# Altium project PCB_Braco_Robotico.PrjPcb
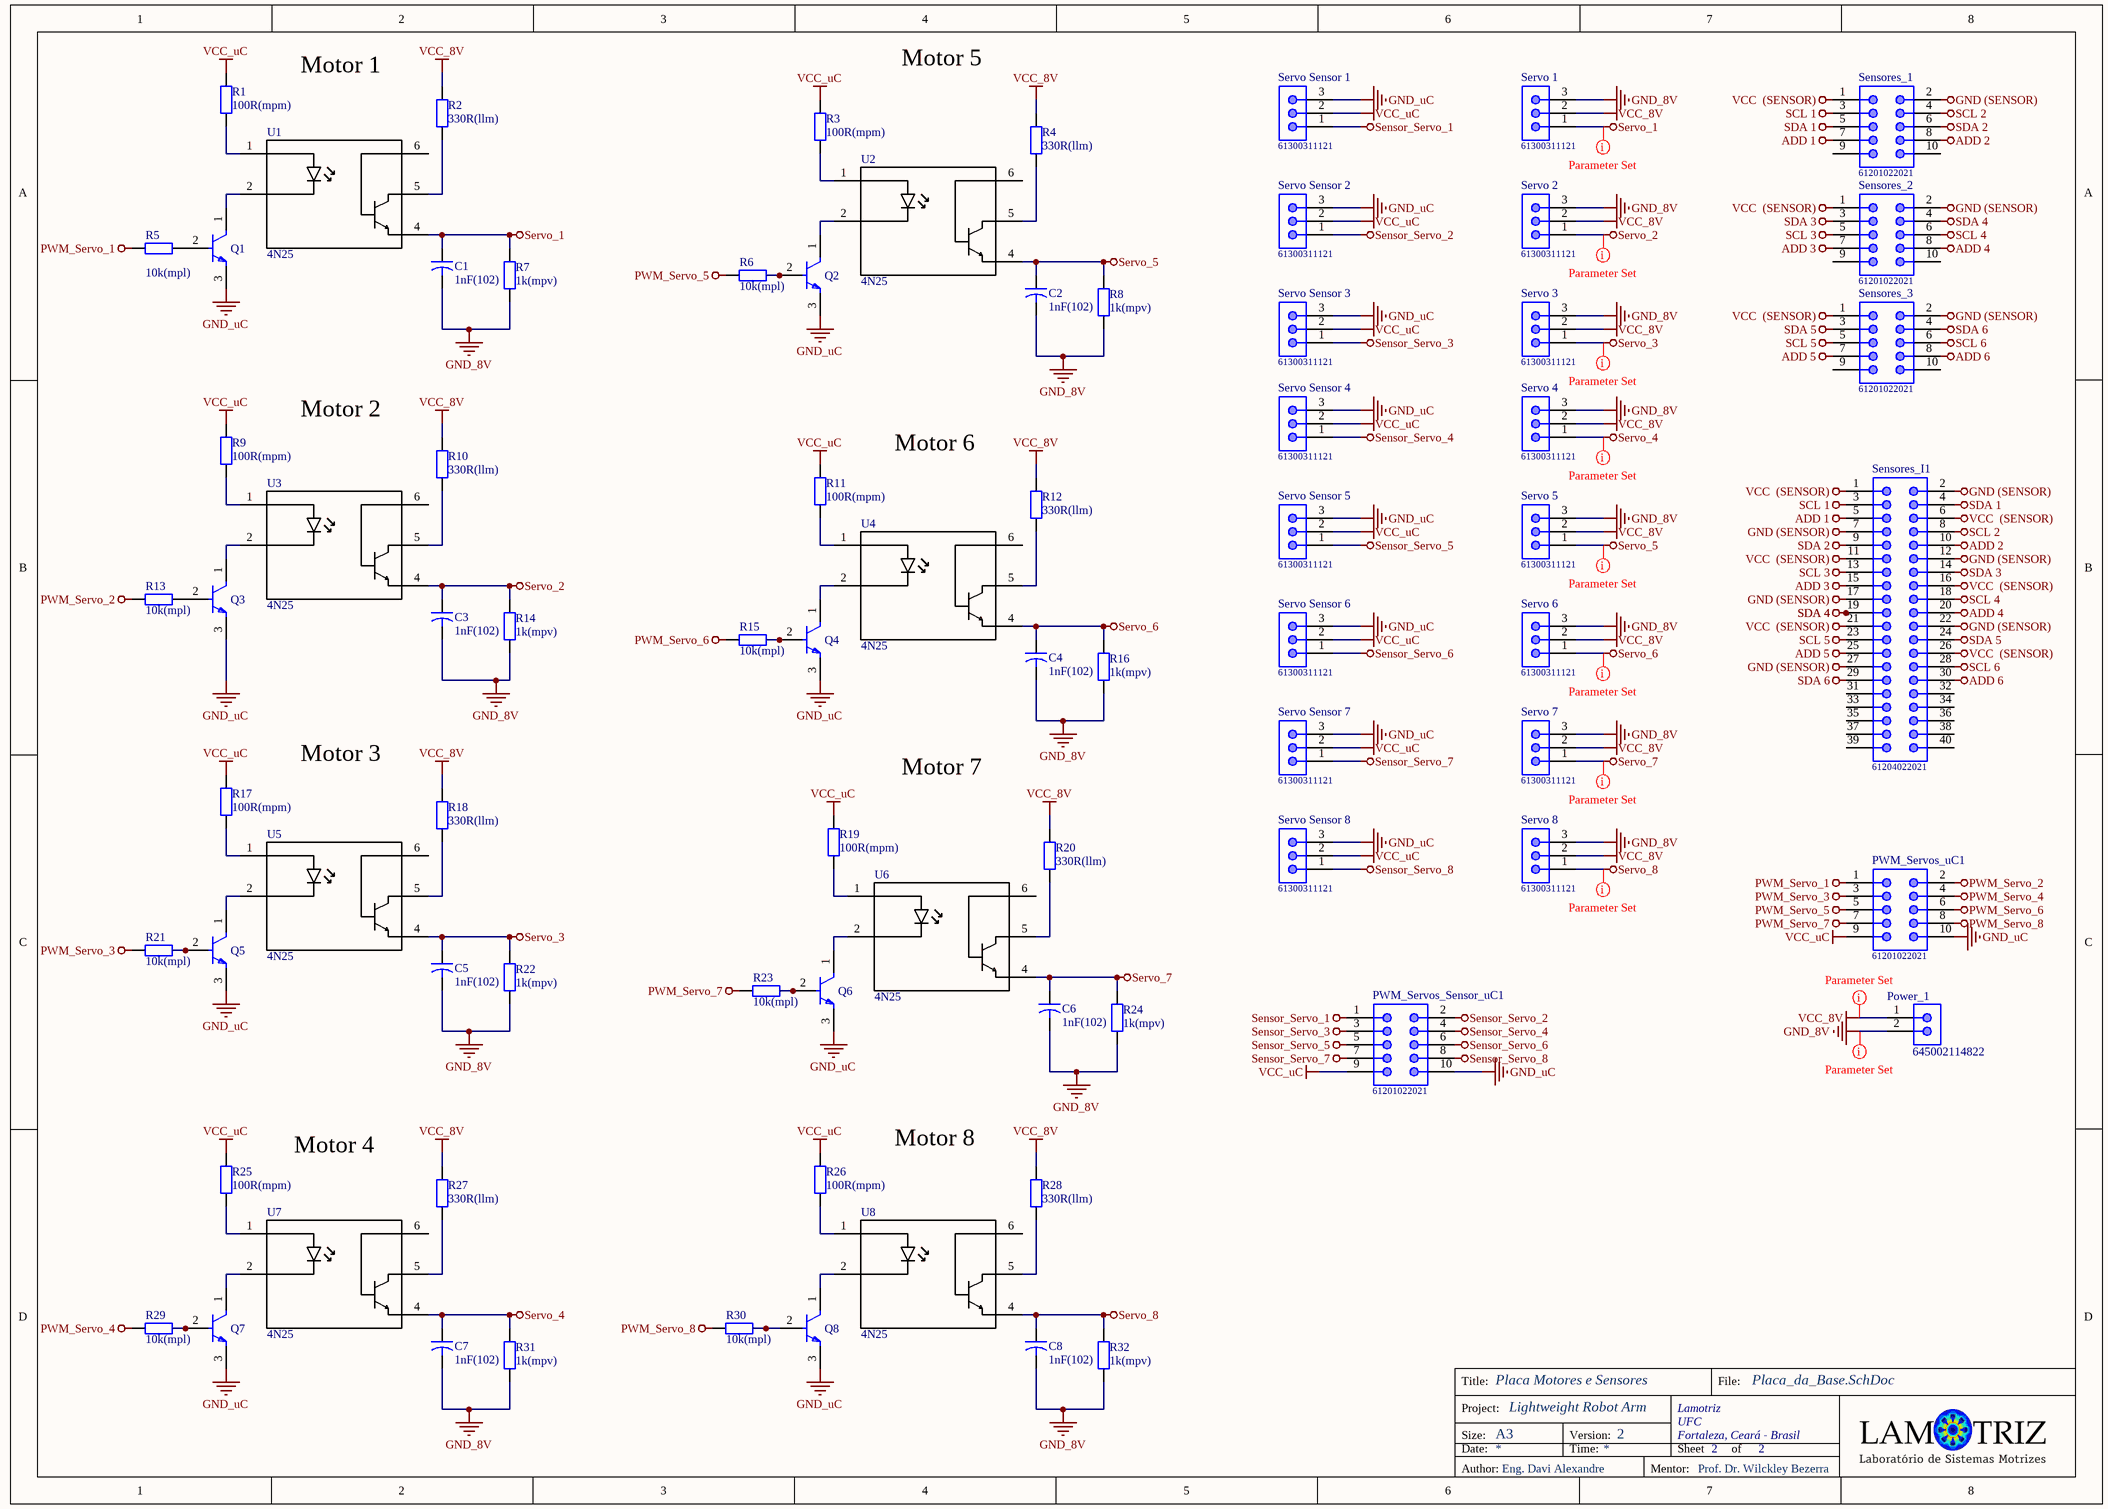
[diagram p0: Placa_da_Base.SchDoc]
PojectName: Lightweight Robot Arm
2 sheets, 85 parts. Net scope: global (net labels, ports and power ports of the same name join across sheets).
Board files: view_PCB_5_Braco_so_motores.PcbDoc, view_PCB_4_Sensores.PcbDoc, view_PCB_3_uC.PcbDoc, PCB_5_Braco_so_motores.PcbDoc, PCB_4_Sensores.PcbDoc, PCB_3_uC.PcbDoc
Sheets:
  Placa_da_Base.SchDoc
  Placa_do_uControlador.SchDoc

## Sheet Placa_da_Base.SchDoc: Placa Motores e Sensores
size A3; Author: Eng. Davi Alexandre; CompanyName: Lamotriz; Organization: UFC; Address1: Fortaleza, Ceará - Brasil; Revision: Prof. Dr. Wilckley Bezerra; SheetNumber: 2; SheetTotal: 2; Machine: Lightweight Robot Arm; VersionProject: 2

### Parts
C1  1nF(102)  [CAPR5-4X5]
C2  1nF(102)  [CAPR5-4X5]
C3  1nF(102)  [CAPR5-4X5]
C4  1nF(102)  [CAPR5-4X5]
C5  1nF(102)  [CAPR5-4X5]
C6  1nF(102)  [CAPR5-4X5]
C7  1nF(102)  [CAPR5-4X5]
C8  1nF(102)  [CAPR5-4X5]
Power_1  645002114822  [645002114822]
PWM_Servos_Sensor_uC1  61201022021  [61201022021]
PWM_Servos_uC1  61201022021  [61201022021]
Q1  Trans_Fairchild_BC547_eec  [Fairchild_BC547_0]  (value not drawn)
Q2  Trans_Fairchild_BC547_eec  [Fairchild_BC547_0]  (value not drawn)
Q3  Trans_Fairchild_BC547_eec  [Fairchild_BC547_0]  (value not drawn)
Q4  Trans_Fairchild_BC547_eec  [Fairchild_BC547_0]  (value not drawn)
Q5  Trans_Fairchild_BC547_eec  [Fairchild_BC547_0]  (value not drawn)
Q6  Trans_Fairchild_BC547_eec  [Fairchild_BC547_0]  (value not drawn)
Q7  Trans_Fairchild_BC547_eec  [Fairchild_BC547_0]  (value not drawn)
Q8  Trans_Fairchild_BC547_eec  [Fairchild_BC547_0]  (value not drawn)
R1  100R(mpm)  [AXIAL-0.4]
R2  330R(llm)  [AXIAL-0.4]
R3  100R(mpm)  [AXIAL-0.4]
R4  330R(llm)  [AXIAL-0.4]
R5  10k(mpl)  [AXIAL-0.4]
R6  10k(mpl)  [AXIAL-0.4]
R7  1k(mpv)  [AXIAL-0.4]
R8  1k(mpv)  [AXIAL-0.4]
R9  100R(mpm)  [AXIAL-0.4]
R10  330R(llm)  [AXIAL-0.4]
R11  100R(mpm)  [AXIAL-0.4]
R12  330R(llm)  [AXIAL-0.4]
R13  10k(mpl)  [AXIAL-0.4]
R14  1k(mpv)  [AXIAL-0.4]
R15  10k(mpl)  [AXIAL-0.4]
R16  1k(mpv)  [AXIAL-0.4]
R17  100R(mpm)  [AXIAL-0.4]
R18  330R(llm)  [AXIAL-0.4]
R19  100R(mpm)  [AXIAL-0.4]
R20  330R(llm)  [AXIAL-0.4]
R21  10k(mpl)  [AXIAL-0.4]
R22  1k(mpv)  [AXIAL-0.4]
R23  10k(mpl)  [AXIAL-0.4]
R24  1k(mpv)  [AXIAL-0.4]
R25  100R(mpm)  [AXIAL-0.4]
R26  100R(mpm)  [AXIAL-0.4]
R27  330R(llm)  [AXIAL-0.4]
R28  330R(llm)  [AXIAL-0.4]
R29  10k(mpl)  [AXIAL-0.4]
R30  10k(mpl)  [AXIAL-0.4]
R31  1k(mpv)  [AXIAL-0.4]
R32  1k(mpv)  [AXIAL-0.4]
Sensores_1  61201022021  [61201022021]
Sensores_2  61201022021  [61201022021]
Sensores_3  61201022021  [61201022021]
Sensores_I1  61204022021  [61204022021]
Servo_1  61300311121  [61300311121]
Servo_2  61300311121  [61300311121]
Servo_3  61300311121  [61300311121]
Servo_4  61300311121  [61300311121]
Servo_5  61300311121  [61300311121]
Servo_6  61300311121  [61300311121]
Servo_7  61300311121  [61300311121]
Servo_8  61300311121  [61300311121]
Servo_Sensor_1  61300311121  [61300311121]
Servo_Sensor_2  61300311121  [61300311121]
Servo_Sensor_3  61300311121  [61300311121]
Servo_Sensor_4  61300311121  [61300311121]
Servo_Sensor_5  61300311121  [61300311121]
Servo_Sensor_6  61300311121  [61300311121]
Servo_Sensor_7  61300311121  [61300311121]
Servo_Sensor_8  61300311121  [61300311121]
U1  4N25  [*DIP762W50P254L712H400Q6N]
U2  4N25  [*DIP762W50P254L712H400Q6N]
U3  4N25  [*DIP762W50P254L712H400Q6N]
U4  4N25  [*DIP762W50P254L712H400Q6N]
U5  4N25  [*DIP762W50P254L712H400Q6N]
U6  4N25  [*DIP762W50P254L712H400Q6N]
U7  4N25  [*DIP762W50P254L712H400Q6N]
U8  4N25  [*DIP762W50P254L712H400Q6N]

### Nets
ADD 1: Sensores_1.7 Sensores_2.7 Sensores_3.7 Sensores_I1.5 Sensores_I1.15 Sensores_I1.25  [also labelled ADD 3, ADD 5]  [project net 3V3_uC]
ADD 2: PWM_Servos_Sensor_uC1.10 PWM_Servos_uC1.10 Q1.3(E) Q2.3(E) Q3.3(E) Q4.3(E) Q5.3(E) Q6.3(E) Q7.3(E) Q8.3(E) Sensores_1.8 Sensores_2.8 Sensores_3.8 Sensores_I1.10 Sensores_I1.20 Sensores_I1.30 Servo_Sensor_1.3 Servo_Sensor_2.3 Servo_Sensor_3.3 Servo_Sensor_4.3 Servo_Sensor_5.3 Servo_Sensor_6.3 Servo_Sensor_7.3 Servo_Sensor_8.3  [also labelled ADD 4, ADD 6, GND_uC]
GND (SENSOR): Sensores_1.2 Sensores_2.2 Sensores_3.2 Sensores_I1.2 Sensores_I1.7 Sensores_I1.12 Sensores_I1.17 Sensores_I1.22 Sensores_I1.27
GND_8V: C1.2 C2.2 C3.2 C4.2 C5.2 C6.2 C7.2 C8.2 Power_1.2 R7.1 R8.1 R14.1 R16.1 R22.1 R24.1 R31.1 R32.1 Servo_1.3 Servo_2.3 Servo_3.3 Servo_4.3 Servo_5.3 Servo_6.3 Servo_7.3 Servo_8.3
PWM_Servo_1: PWM_Servos_uC1.1 R5.2
PWM_Servo_2: PWM_Servos_uC1.2 R13.2
PWM_Servo_3: PWM_Servos_uC1.3 R21.2
PWM_Servo_4: PWM_Servos_uC1.4 R29.2
PWM_Servo_5: PWM_Servos_uC1.5 R6.2
PWM_Servo_6: PWM_Servos_uC1.6 R15.2
PWM_Servo_7: PWM_Servos_uC1.7 R23.2
PWM_Servo_8: PWM_Servos_uC1.8 R30.2
SCL 1: Sensores_1.3 Sensores_1.4 Sensores_I1.3 Sensores_I1.8  [also labelled SCL 2]  [project net I2C1-SCL]
SCL 3: Sensores_2.5 Sensores_2.6 Sensores_I1.13 Sensores_I1.18  [also labelled SCL 4]  [project net I2C2-SCL]
SCL 5: Sensores_3.5 Sensores_3.6 Sensores_I1.23 Sensores_I1.28  [also labelled SCL 6]  [project net I2C3-SCL]
SDA 1: Sensores_1.5 Sensores_1.6 Sensores_I1.4 Sensores_I1.9  [also labelled SDA 2]  [project net I2C1-SDA]
SDA 3: Sensores_2.3 Sensores_2.4 Sensores_I1.14 Sensores_I1.19  [also labelled SDA 4]  [project net I2C2-SDA]
SDA 5: Sensores_3.3 Sensores_3.4 Sensores_I1.24 Sensores_I1.29  [also labelled SDA 6]  [project net I2C3-SDA]
Sensor_Servo_1: PWM_Servos_Sensor_uC1.1 Servo_Sensor_1.1
Sensor_Servo_2: PWM_Servos_Sensor_uC1.2 Servo_Sensor_2.1
Sensor_Servo_3: PWM_Servos_Sensor_uC1.3 Servo_Sensor_3.1
Sensor_Servo_4: PWM_Servos_Sensor_uC1.4 Servo_Sensor_4.1
Sensor_Servo_5: PWM_Servos_Sensor_uC1.5 Servo_Sensor_5.1
Sensor_Servo_6: PWM_Servos_Sensor_uC1.6 Servo_Sensor_6.1
Sensor_Servo_7: PWM_Servos_Sensor_uC1.7 Servo_Sensor_7.1
Sensor_Servo_8: PWM_Servos_Sensor_uC1.8 Servo_Sensor_8.1
Servo_1: C1.1 R7.2 Servo_1.1 U1.4(E)
Servo_2: C3.1 R14.2 Servo_2.1 U3.4(E)
Servo_3: C5.1 R22.2 Servo_3.1 U5.4(E)
Servo_4: C7.1 R31.2 Servo_4.1 U7.4(E)
Servo_5: C2.1 R8.2 Servo_5.1 U2.4(E)
Servo_6: C4.1 R16.2 Servo_6.1 U4.4(E)
Servo_7: C6.1 R24.2 Servo_7.1 U6.4(E)
Servo_8: C8.1 R32.2 Servo_8.1 U8.4(E)
VCC  (SENSOR): Sensores_1.1 Sensores_2.1 Sensores_3.1 Sensores_I1.1 Sensores_I1.6 Sensores_I1.11 Sensores_I1.16 Sensores_I1.21 Sensores_I1.26
VCC_8V: Power_1.1 R2.2 R4.2 R10.2 R12.2 R18.2 R20.2 R27.2 R28.2 Servo_1.2 Servo_2.2 Servo_3.2 Servo_4.2 Servo_5.2 Servo_6.2 Servo_7.2 Servo_8.2
VCC_uC: PWM_Servos_Sensor_uC1.9 PWM_Servos_uC1.9 R1.2 R3.2 R9.2 R11.2 R17.2 R19.2 R25.2 R26.2 Servo_Sensor_1.2 Servo_Sensor_2.2 Servo_Sensor_3.2 Servo_Sensor_4.2 Servo_Sensor_5.2 Servo_Sensor_6.2 Servo_Sensor_7.2 Servo_Sensor_8.2
NetQ1_1: Q1.1(C) U1.2(K)
NetQ1_2: Q1.2(B) R5.1
NetQ2_1: Q2.1(C) U2.2(K)
NetQ2_2: Q2.2(B) R6.1
NetQ3_1: Q3.1(C) U3.2(K)
NetQ3_2: Q3.2(B) R13.1
NetQ4_1: Q4.1(C) U4.2(K)
NetQ4_2: Q4.2(B) R15.1
NetQ5_1: Q5.1(C) U5.2(K)
NetQ5_2: Q5.2(B) R21.1
NetQ6_1: Q6.1(C) U6.2(K)
NetQ6_2: Q6.2(B) R23.1
NetQ7_1: Q7.1(C) U7.2(K)
NetQ7_2: Q7.2(B) R29.1
NetQ8_1: Q8.1(C) U8.2(K)
NetQ8_2: Q8.2(B) R30.1
NetR1_1: R1.1 U1.1(A)
NetR2_1: R2.1 U1.5(C)
NetR3_1: R3.1 U2.1(A)
NetR4_1: R4.1 U2.5(C)
NetR9_1: R9.1 U3.1(A)
NetR10_1: R10.1 U3.5(C)
NetR11_1: R11.1 U4.1(A)
NetR12_1: R12.1 U4.5(C)
NetR17_1: R17.1 U5.1(A)
NetR18_1: R18.1 U5.5(C)
NetR19_1: R19.1 U6.1(A)
NetR20_1: R20.1 U6.5(C)
NetR25_1: R25.1 U7.1(A)
NetR26_1: R26.1 U8.1(A)
NetR27_1: R27.1 U7.5(C)
NetR28_1: R28.1 U8.5(C)

Not connected (* = marked no-connect by the designer): Sensores_1 9 10; Sensores_2 9 10; Sensores_3 9 10; Sensores_I1 31 32 33 34 35 36 37 38 39 40; U1 6(B); U2 6(B); U3 6(B); U4 6(B); U5 6(B); U6 6(B); U7 6(B); U8 6(B)

### Layout directives
rule Width Constraint [Pref Width = 60mil    Min Width = 50mil    Max Width = 60mil]: VCC_8V
rule Width Constraint [Pref Width = 50mil    Min Width = 50mil    Max Width = 50mil]: GND_8V
rule Width Constraint [Pref Width = 30mil    Min Width = 30mil    Max Width = 30mil]: Servo_1, Servo_2, Servo_3, Servo_4, Servo_5, Servo_6, Servo_7, Servo_8

### Notes on the sheet
- Motor 1
- Motor 5
- Motor 2
- Motor 6
- Motor 3
- Motor 7
- Motor 4
- Motor 8
- Title:
- File:
- Project:
- Size:
- Date:
- A3
- Version:
- Time:
- Sheet
- of
- Author:
- Mentor:

### Library data of the parts
C1-C8 = Cap2: Capacitor; Published: 23-Sep-2002; PackageReference: CAPR5-4X5; Publisher: Altium Limited; PackageDescription: Capacitor; 2 Leads
Power_1 = 645002114822: WR-WTB THT Male Vertical Locking Header, pitch 3.96mm, 2p; Pin Number: 2; Contact Resistance: 20mOhm; Rated Current: 7A; Withstanding Voltage: 1500VAC; Working Voltage: 250VAC; ComponentLink1Description: Manufacturer; ComponentLink1URL: http://www.we-online.de; ComponentLink2Description: Datasheet; ComponentLink2URL: https://www.we-online.com/catalog/datasheet/645002114822.pdf; Pitch: 3.96mm; Published Date: January 2020; Publisher: Wurth Elektronik; Mounting Technology: THT; Packaging: Bag; Operating Temperature: -40 to +105degC; Part Number: 645002114822; Gender: Male; Type: Vertical
PWM_Servos_Sensor_uC1 PWM_Servos_uC1 Sensores_1-Sensores_3 = 61201022021: Male Box Header WR-BHD with lever, THT, Vertical, pitch 2.54 mm, 10 pins; Pitch: 2.54 mm; Working Voltage: 250 VAC; Withstanding Voltage: 500 VAC; Contact Resistance: 20 mOhm; Pin Number: 10; ComponentLink1Description: Manufacturer; ComponentLink1URL: http://www.we-online.de; ComponentLink2Description: Datasheet; ComponentLink2URL: https://katalog.we-online.de/em/datasheet/6120xx22021.pdf; Part Number: 61201022021; Published Date: August 2018; Publisher: Wurth Elektronik; Operating Temperature: -40 to 125 degC; Packaging: Tray; Gender: Male; Mounting Technology: THT; Orientation: Vertical
Q1-Q8 = Trans_Fairchild_BC547_eec: TRANS NPN 45V 0.1A TO-92; Part Number: BC547; Power: 500mW; helpURL: https://upverter.com/upn/revision/b6c8bf2a31a37ee3/; ComponentLink2Description: Datasheet; Temperature: -65°C to +150°C; Package: TO-92; Supplier 2: Mouser; Supplier 1: Digi-Key; ComponentLink1URL: https://upverter.com/upn/revision/b6c8bf2a31a37ee3/; Supplier Part Number 2: 512-BC547; Supplier Part Number 1: BC547-ND; Manufacturer: Fairchild; ComponentLink1Description: Upverter; ComponentLink2URL: https://upverter.com/datasheet/00a4bcea94b7f6a06c7169869aec7b7ac700d7c3.pdf; RoHS: TRUE; Mouser Part Number: 512-BC547; Ipc Land Pattern Name: TO-92; Temperature Range High: +150°C; Digikey Description: TRANS NPN 45V 0.1A TO-92; Digikey Part Number: BC547-ND; Lead Free: yes; Temperature Range Low: -65°C
R1 R3-R32 = Res2: Resistor; Published: 8-Jun-2000; LatestRevisionDate: 17-Jul-2002; LatestRevisionNote: Re-released for DXP Platform.; PackageReference: AXIAL-0.4; Publisher: Altium Limited; PackageDescription: Axial Device, Thru-Hole; 2 Leads; 0.4 in Pin Spacing
  R1: Value: 100R(mpm)
  R5: Value: 10k(mpl)
R2 = Res2: Resistor; Value: 10K (mpl); Published: 8-Jun-2000; LatestRevisionDate: 17-Jul-2002; LatestRevisionNote: Re-released for DXP Platform.; PackageReference: AXIAL-0.4; Publisher: Altium Limited; PackageDescription: Axial Device, Thru-Hole; 2 Leads; 0.4 in Pin Spacing
Sensores_I1 = 61204022021: Male Box Header WR-BHD with lever, THT, Vertical, pitch 2.54 mm, 40 pins; Pitch: 2.54 mm; Working Voltage: 250 VAC; Withstanding Voltage: 500 VAC; Contact Resistance: 20 mOhm; Pin Number: 40; ComponentLink1Description: Manufacturer; ComponentLink1URL: http://www.we-online.de; ComponentLink2Description: Datasheet; ComponentLink2URL: https://katalog.we-online.de/em/datasheet/6120xx22021.pdf; Part Number: 61204022021; Published Date: August 2018; Publisher: Wurth Elektronik; Operating Temperature: -40 to 125 degC; Packaging: Tray; Gender: Male; Mounting Technology: THT; Orientation: Vertical
Servo_1-Servo_8 Servo_Sensor_1-Servo_Sensor_8 = 61300311121: WR-PHD Pin Header, THT, pitch 2.54mm, Single Row, Vertical, 3pin; Pin Number: 3; Gender: Male; Rated Current: 3A; Working Voltage: 250VAC; Withstanding Voltage: 500VAC; Contact Resistance: 20mOhm; ComponentLink1Description: Manufacturer; ComponentLink1URL: http://www.we-online.de; ComponentLink2Description: Datasheet; ComponentLink2URL: https://katalog.we-online.de/em/datasheet/6130xx11121.pdf; Part Number: 61300311121; Published Date: June 2019; Publisher: Wurth Elektronik; Pitch: 2.54mm; Operating Temperature: -40 to +105degC; Mounting Technology: THT; Packaging: Bag; Row Number: Single; Orientation: Vertical
U1-U8 = 4N25: Optoisolator Transistor with Base Output 5000Vrms 1 Channel 6-DIP; MF: Vishay Semiconductor; Digi-Key_Purchase_URL: https://www.digikey.com/product-detail/en/vishay-semiconductor-opto-division/4N25/4N25VS-ND/1738516?utm_source=snapeda&utm_medium=aggregator&utm_campaign=symbol; Digi-Key_Part_Number: 4N25VS-ND; Package: DIP-6 Lite-On; SnapEDA_Link: https://www.snapeda.com/parts/4N25/Vishay%20Semiconductor%20Opto%20Division/view-part/641454/?ref=snap; MP: 4N25; Value: *

## Sheet Placa_do_uControlador.SchDoc: Conections MSP432P401r - Texas
size A4; Author: Eng. Davi Alexandre; CompanyName: Lamotriz; Organization: UFC; Address1: Fortaleza, Ceará - Brasil; Address2: Frenchs Forest; Address3: NSW; Address4: Australia 2086; Revision: Prof. Dr. Wilclkey Bezerra; SheetNumber: 1; SheetTotal: 2; Machine: Lightweight Robot Arm; VersionProject: 2
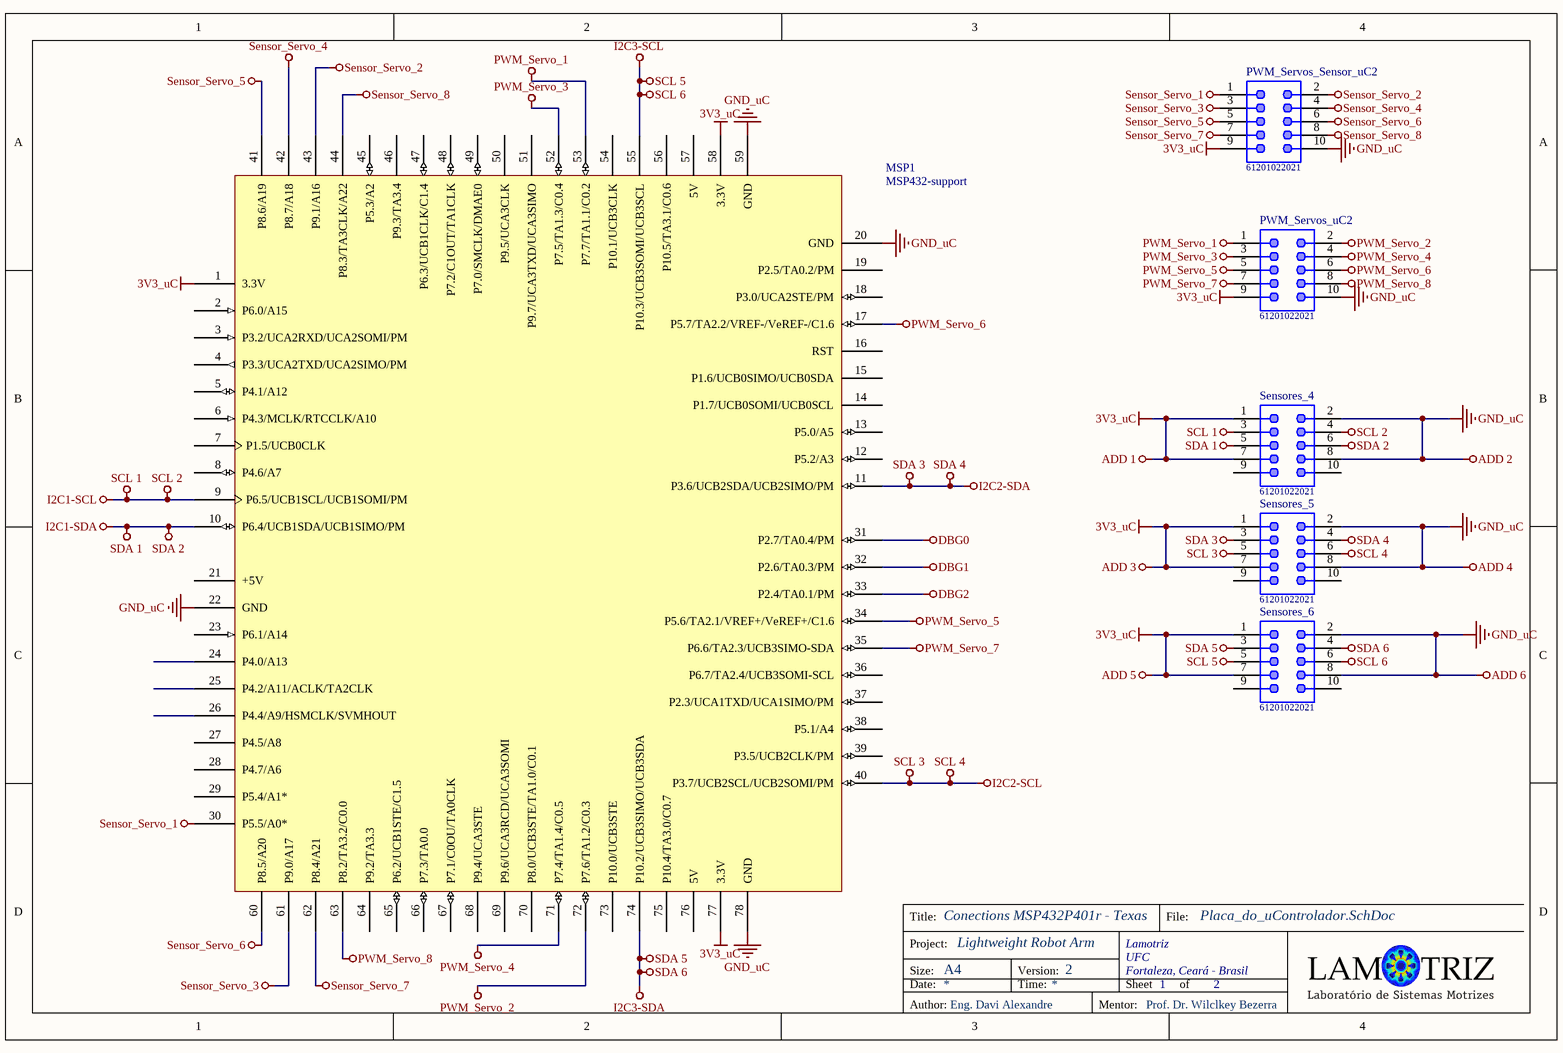
[diagram p1: Placa_do_uControlador.SchDoc]

### Parts
MSP1  MSP432-support  [Msp432_Suport]
PWM_Servos_Sensor_uC2  61201022021  [61201022021]
PWM_Servos_uC2  61201022021  [61201022021]
Sensores_4  61201022021  [61201022021]
Sensores_5  61201022021  [61201022021]
Sensores_6  61201022021  [61201022021]

### Nets
3V3_uC: MSP1.1(3.3V) MSP1.58(3.3V) MSP1.77(3.3V) PWM_Servos_Sensor_uC2.9 PWM_Servos_uC2.9 Sensores_4.1 Sensores_4.7 Sensores_5.1 Sensores_5.7 Sensores_6.1 Sensores_6.7  [also labelled ADD 1, ADD 3, ADD 5]
ADD 2: MSP1.20(GND) MSP1.22(GND) MSP1.59(GND) MSP1.78(GND) PWM_Servos_Sensor_uC2.10 PWM_Servos_uC2.10 Sensores_4.2 Sensores_4.8 Sensores_5.2 Sensores_5.8 Sensores_6.2 Sensores_6.8  [also labelled ADD 4, ADD 6, GND_uC]
DBG0: MSP1.31(P2.7/TA0.4/PM)
DBG1: MSP1.32(P2.6/TA0.3/PM)
DBG2: MSP1.33(P2.4/TA0.1/PM)
I2C1-SCL: MSP1.9(P6.5/UCB1SCL/UCB1SOMI/PM) Sensores_4.3 Sensores_4.4  [also labelled SCL 1, SCL 2]
I2C1-SDA: MSP1.10(P6.4/UCB1SDA/UCB1SIMO/PM) Sensores_4.5 Sensores_4.6  [also labelled SDA 1, SDA 2]
I2C2-SCL: MSP1.40(P3.7/UCB2SCL/UCB2SOMI/PM) Sensores_5.5 Sensores_5.6  [also labelled SCL 3, SCL 4]
I2C2-SDA: MSP1.11(P3.6/UCB2SDA/UCB2SIMO/PM) Sensores_5.3 Sensores_5.4  [also labelled SDA 3, SDA 4]
I2C3-SCL: MSP1.55(P10.3/UCB3SOMI/UCB3SCL) Sensores_6.5 Sensores_6.6  [also labelled SCL 5, SCL 6]
I2C3-SDA: MSP1.74(P10.2/UCB3SIMO/UCB3SDA) Sensores_6.3 Sensores_6.4  [also labelled SDA 5, SDA 6]
PWM_Servo_1: MSP1.53(P7.7/TA1.1/C0.2) PWM_Servos_uC2.1
PWM_Servo_2: MSP1.72(P7.6/TA1.2/C0.3) PWM_Servos_uC2.2
PWM_Servo_3: MSP1.52(P7.5/TA1.3/C0.4) PWM_Servos_uC2.3
PWM_Servo_4: MSP1.71(P7.4/TA1.4/C0.5) PWM_Servos_uC2.4
PWM_Servo_5: MSP1.34(P5.6/TA2.1/VREF+/VeREF+/C1.6) PWM_Servos_uC2.5
PWM_Servo_6: MSP1.17(P5.7/TA2.2/VREF-/VeREF-/C1.6) PWM_Servos_uC2.6
PWM_Servo_7: MSP1.35(P6.6/TA2.3/UCB3SIMO-SDA) PWM_Servos_uC2.7
PWM_Servo_8: MSP1.63(P8.2/TA3.2/C0.0) PWM_Servos_uC2.8
Sensor_Servo_1: MSP1.30(P5.5/A0*) PWM_Servos_Sensor_uC2.1
Sensor_Servo_2: MSP1.43(P9.1/A16) PWM_Servos_Sensor_uC2.2
Sensor_Servo_3: MSP1.61(P9.0/A17) PWM_Servos_Sensor_uC2.3
Sensor_Servo_4: MSP1.42(P8.7/A18) PWM_Servos_Sensor_uC2.4
Sensor_Servo_5: MSP1.41(P8.6/A19) PWM_Servos_Sensor_uC2.5
Sensor_Servo_6: MSP1.60(P8.5/A20) PWM_Servos_Sensor_uC2.6
Sensor_Servo_7: MSP1.62(P8.4/A21) PWM_Servos_Sensor_uC2.7
Sensor_Servo_8: MSP1.44(P8.3/TA3CLK/A22) PWM_Servos_Sensor_uC2.8

Not connected (* = marked no-connect by the designer): MSP1 2(P6.0/A15) 3(P3.2/UCA2RXD/UCA2SOMI/PM) 4(P3.3/UCA2TXD/UCA2SIMO/PM) 5(P4.1/A12) 6(P4.3/MCLK/RTCCLK/A10) 7(P1.5/UCB0CLK) 8(P4.6/A7) 12(P5.2/A3) 13(P5.0/A5) 14(P1.7/UCB0SOMI/UCB0SCL) 15(P1.6/UCB0SIMO/UCB0SDA) 16(RST) 18(P3.0/UCA2STE/PM) 19(P2.5/TA0.2/PM) 21(+5V) 23(P6.1/A14) 24(P4.0/A13) 25(P4.2/A11/ACLK/TA2CLK) 26(P4.4/A9/HSMCLK/SVMHOUT) 27(P4.5/A8) 28(P4.7/A6) 29(P5.4/A1*) 36(P6.7/TA2.4/UCB3SOMI-SCL) 37(P2.3/UCA1TXD/UCA1SIMO/PM) 38(P5.1/A4) 39(P3.5/UCB2CLK/PM) 45(P5.3/A2) 46(P9.3/TA3.4) 47(P6.3/UCB1CLK/C1.4) 48(P7.2/C1OUT/TA1CLK) 49(P7.0/SMCLK/DMAE0) 50(P9.5/UCA3CLK) 51(P9.7/UCA3TXD/UCA3SIMO) 54(P10.1/UCB3CLK) 56(P10.5/TA3.1/C0.6) 57(5V) 64(P9.2/TA3.3) 65(P6.2/UCB1STE/C1.5) 66(P7.3/TA0.0) 67(P7.1/C0OU/TA0CLK) 68(P9.4/UCA3STE) 69(P9.6/UCA3RCD/UCA3SOMI) 70(P8.0/UCB3STE/TA1.0/C0.1) 73(P10.0/UCB3STE) 75(P10.4/TA3.0/C0.7) 76(5V); Sensores_4 9 10; Sensores_5 9 10; Sensores_6 9 10

### Notes on the sheet
- Title:
- File:
- Project:
- Size:
- Date:
- A4
- Version:
- Time:
- Sheet
- of
- Author:
- Mentor:

### Library data of the parts
MSP1 = U*
PWM_Servos_Sensor_uC2 PWM_Servos_uC2 Sensores_4-Sensores_6 = 61201022021: as PWM_Servos_Sensor_uC1 on sheet Placa_da_Base; ComponentLink1Description: Manufacturer; ComponentLink1URL: http://www.we-online.de; ComponentLink2Description: Datasheet; ComponentLink2URL: https://katalog.we-online.de/em/datasheet/6120xx22021.pdf; Part Number: 61201022021; Published Date: August 2018; Publisher: Wurth Elektronik; Operating Temperature: -40 to 125 degC; Packaging: Tray; Gender: Male; Mounting Technology: THT; Orientation: Vertical

## Nets that join several sheets
3V3_uC: Placa_da_Base (6 pins), Placa_do_uControlador (11 pins)
ADD 2: Placa_da_Base (24 pins), Placa_do_uControlador (12 pins)
I2C1-SCL: Placa_da_Base (Sensores_1.3 Sensores_1.4 Sensores_I1.3 Sensores_I1.8), Placa_do_uControlador (MSP1.9 Sensores_4.3 Sensores_4.4)
I2C1-SDA: Placa_da_Base (Sensores_1.5 Sensores_1.6 Sensores_I1.4 Sensores_I1.9), Placa_do_uControlador (MSP1.10 Sensores_4.5 Sensores_4.6)
I2C2-SCL: Placa_da_Base (Sensores_2.5 Sensores_2.6 Sensores_I1.13 Sensores_I1.18), Placa_do_uControlador (MSP1.40 Sensores_5.5 Sensores_5.6)
I2C2-SDA: Placa_da_Base (Sensores_2.3 Sensores_2.4 Sensores_I1.14 Sensores_I1.19), Placa_do_uControlador (MSP1.11 Sensores_5.3 Sensores_5.4)
I2C3-SCL: Placa_da_Base (Sensores_3.5 Sensores_3.6 Sensores_I1.23 Sensores_I1.28), Placa_do_uControlador (MSP1.55 Sensores_6.5 Sensores_6.6)
I2C3-SDA: Placa_da_Base (Sensores_3.3 Sensores_3.4 Sensores_I1.24 Sensores_I1.29), Placa_do_uControlador (MSP1.74 Sensores_6.3 Sensores_6.4)
PWM_Servo_1: Placa_da_Base (PWM_Servos_uC1.1 R5.2), Placa_do_uControlador (MSP1.53 PWM_Servos_uC2.1)
PWM_Servo_2: Placa_da_Base (PWM_Servos_uC1.2 R13.2), Placa_do_uControlador (MSP1.72 PWM_Servos_uC2.2)
PWM_Servo_3: Placa_da_Base (PWM_Servos_uC1.3 R21.2), Placa_do_uControlador (MSP1.52 PWM_Servos_uC2.3)
PWM_Servo_4: Placa_da_Base (PWM_Servos_uC1.4 R29.2), Placa_do_uControlador (MSP1.71 PWM_Servos_uC2.4)
PWM_Servo_5: Placa_da_Base (PWM_Servos_uC1.5 R6.2), Placa_do_uControlador (MSP1.34 PWM_Servos_uC2.5)
PWM_Servo_6: Placa_da_Base (PWM_Servos_uC1.6 R15.2), Placa_do_uControlador (MSP1.17 PWM_Servos_uC2.6)
PWM_Servo_7: Placa_da_Base (PWM_Servos_uC1.7 R23.2), Placa_do_uControlador (MSP1.35 PWM_Servos_uC2.7)
PWM_Servo_8: Placa_da_Base (PWM_Servos_uC1.8 R30.2), Placa_do_uControlador (MSP1.63 PWM_Servos_uC2.8)
Sensor_Servo_1: Placa_da_Base (PWM_Servos_Sensor_uC1.1 Servo_Sensor_1.1), Placa_do_uControlador (MSP1.30 PWM_Servos_Sensor_uC2.1)
Sensor_Servo_2: Placa_da_Base (PWM_Servos_Sensor_uC1.2 Servo_Sensor_2.1), Placa_do_uControlador (MSP1.43 PWM_Servos_Sensor_uC2.2)
Sensor_Servo_3: Placa_da_Base (PWM_Servos_Sensor_uC1.3 Servo_Sensor_3.1), Placa_do_uControlador (MSP1.61 PWM_Servos_Sensor_uC2.3)
Sensor_Servo_4: Placa_da_Base (PWM_Servos_Sensor_uC1.4 Servo_Sensor_4.1), Placa_do_uControlador (MSP1.42 PWM_Servos_Sensor_uC2.4)
Sensor_Servo_5: Placa_da_Base (PWM_Servos_Sensor_uC1.5 Servo_Sensor_5.1), Placa_do_uControlador (MSP1.41 PWM_Servos_Sensor_uC2.5)
Sensor_Servo_6: Placa_da_Base (PWM_Servos_Sensor_uC1.6 Servo_Sensor_6.1), Placa_do_uControlador (MSP1.60 PWM_Servos_Sensor_uC2.6)
Sensor_Servo_7: Placa_da_Base (PWM_Servos_Sensor_uC1.7 Servo_Sensor_7.1), Placa_do_uControlador (MSP1.62 PWM_Servos_Sensor_uC2.7)
Sensor_Servo_8: Placa_da_Base (PWM_Servos_Sensor_uC1.8 Servo_Sensor_8.1), Placa_do_uControlador (MSP1.44 PWM_Servos_Sensor_uC2.8)